# EAGLE design FR5969_BME280_v2.0.2 (EAGLE 8.1.0)
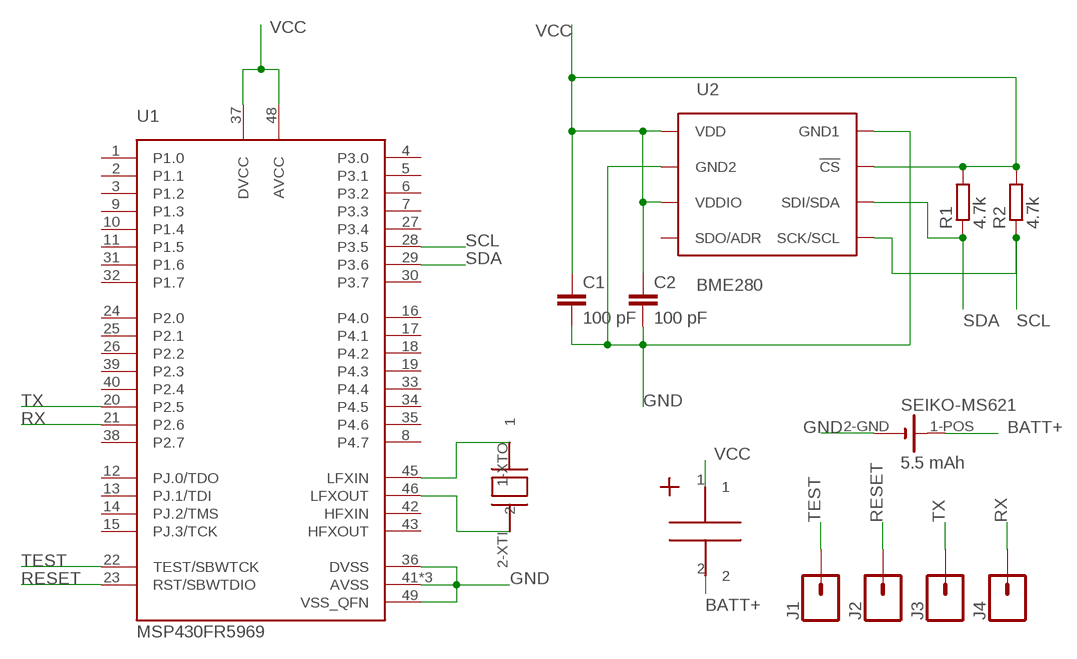
[diagram p0: schematic, sheet 1]

## Parts
C1  100 pF  C-EUC0201  [C0201]
C2  100 pF  C-EUC0201  [C0201]
J1  CONN_01  [1X01]
J2  CONN_01  [1X01]
J3  CONN_01  [1X01]
J4  CONN_01  [1X01]
R1  4.7k  R-EU_R0201  [R0201]
R2  4.7k  R-EU_R0201  [R0201]
SEIKO-MS621  5.5 mAh  SEIKO-MS621  [SEIKO_MICRO]
U1  MSP430FR5969  [S-PVQFN-N48]
U2  BME280  [BME280_LGA]
U$1  CPX3225  [CPX3225_CHIP-CAP]
U$2  ABS06  [2.0X1.0RTC]

## Nets
BATT+: SEIKO-MS621.1-POS(+) U$1.2
GND: C1.2 C2.2 SEIKO-MS621.2-GND(-) U1.36(DVSS) U1.41(AVSS) U1.44(AVSS) U1.47(AVSS) U1.49(VSS_QFN) U2.P$1(GND1) U2.P$7(GND2)
N$1: U1.46(LFXOUT) U$2.2-XTI
N$2: U1.45(LFXIN) U$2.1-XTO
RESET: J2.1 U1.23(RST/SBWTDIO)
RX: J4.1 U1.21(P2.6)
SCL: R2.1 U1.28(P3.5) U2.P$4(SCK/SCL)
SDA: R1.1 U1.29(P3.6) U2.P$3(SDI/SDA)
TEST: J1.1 U1.22(TEST/SBWTCK)
TX: J3.1 U1.20(P2.5)
VCC: C1.1 C2.1 R1.2 R2.2 U1.37(DVCC) U1.48(AVCC) U2.P$2(!CS) U2.P$6(VDDIO) U2.P$8(VDD) U$1.1
Unconnected: U1.1(P1.0) U1.2(P1.1) U1.3(P1.2) U1.4(P3.0) U1.5(P3.1) U1.6(P3.2) U1.7(P3.3) U1.8(P4.7) U1.9(P1.3) U1.10(P1.4) U1.11(P1.5) U1.12(PJ.0/TDO) U1.13(PJ.1/TDI) U1.14(PJ.2/TMS) U1.15(PJ.3/TCK) U1.16(P4.0) U1.17(P4.1) U1.18(P4.2) U1.19(P4.3) U1.24(P2.0) U1.25(P2.1) U1.26(P2.2) U1.27(P3.4) U1.30(P3.7) U1.31(P1.6) U1.32(P1.7) U1.33(P4.4) U1.34(P4.5) U1.35(P4.6) U1.38(P2.7) U1.39(P2.3) U1.40(P2.4) U1.42(HFXIN) U1.43(HFXOUT) U2.P$5(SDO/ADR)

## Library data of the parts
C1 C2 = resistor:C-EU: CAPACITOR, European symbol
J1-J4 = SparkFun-Connectors:CONN_01: Single connection point. Often used as Generic Header-pin footprint for 0.1 inch spaced/style header connections On any of the 0.1 inch spaced packages, you can populate with these: Break Away Headers - Straight <https://www.sparkfun.com/products/116> (PRT-00116) Break Away Male Headers - Right Angle <https://www.sparkfun.com/products/553> (PRT-00553) Female Headers <https://www.sparkfun.com/products/115> (PRT-00115) Break Away Headers - Machine Pin <https://www.sparkfun.com/products/117> (PRT-00117) Break Away Female Headers - Swiss Machine Pin <https://www.sparkfun.com/products/743> (PRT-00743) This device is also useful as a general connection point to wire up your design to another part of your project. Our various solder wires solder well into these plated through hole pads. Hook-Up Wire - Assortment (Stranded, 22 AWG) <https://www.sparkfun.com/products/11375> (PRT-11375) Hook-Up Wire - Assortment (Solid Core, 22 AWG) <https://www.sparkfun.com/products/11367> (PRT-11367) View the entire wire category on our website here <https://www.sparkfun.com/categories/141> Special notes: SMTSO-256-ET is a "flush mount" nut for a 4-40 screw. We mostly use this on specialty testbeds; it is a nice way to connect hardware to your PCB at an adjustable hieght. Also note, the SNAP packages are for using a snappable style connector. We sell a baggie of snaps and they are also used on two LilyPad designs: Snap Assortment - 30 pack (male and female) <https://www.sparkfun.com/products/11347> (DEV-11347) LilyPad Arduino SimpleSnap <https://www.sparkfun.com/products/10941> (DEV-10941) LilyPad SimpleSnap Protoboard <https://www.sparkfun.com/products/10940> (DEV-10940)
R1 R2 = resistor:R-EU_: RESISTOR, European symbol
SEIKO-MS621 = battery:SEIKO-MS621
U1 = chips:MSP430FR5969
U2 = BME280ComponentLibrary:BME280; PROD_ID: IC-13090
U$1 = seiko:CPX3225
U$2 = abracon:ABS06

## Board
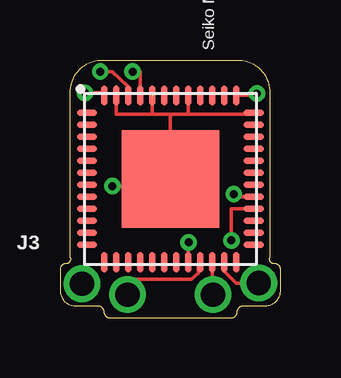
[diagram p1: board, top side]
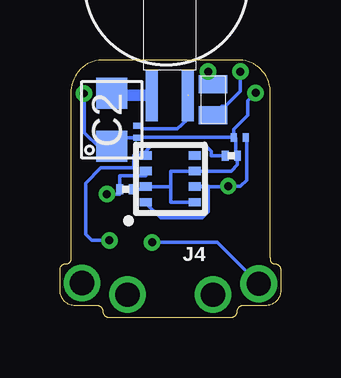
[diagram p2: board, bottom side, seen from below]

Size 9.19 x 10.74 mm. Coordinates in mm from the lower left corner, seen from the top.
Outline: 0,2.01 0,1.14 arc90 0.64,0.51 1.57,0.51 arc-90 1.83,0.25 arc90 2.08,0 7.14,0 arc90 7.39,0.25 arc-90 7.65,0.51 8.56,0.51 arc90 9.19,1.14 9.19,2.01 arc90 8.94,2.26 8.86,2.26 arc-90 8.74,2.51 8.74,9.47 arc90 7.34,10.74 1.83,10.74 arc90 0.43,9.47 0.43,2.51 arc-90 0.3,2.26 0.25,2.26 arc90 0,2.01
Copper layers (1*16): Top 0.0356mm / dielectric 1.5011mm / Bottom 0.0356mm
Design rules "LaenPCBOrder *": minimum track width 6mil, minimum drill 13mil, track to track 6mil, track to pad 6mil, pad to pad 6mil, via to via 6mil, smd to smd 6mil, copper to edge 15mil, drill to drill 6mil, minimum pad ring 7mil, minimum via ring 7mil, stop-mask expansion 3mil, vias tented up to drill 25mil, thermal gap 10mil

### Footprints (pad centres in the part's own frame; a part is rotated, then mirrored left to right if it is on the bottom)
C0201 = smd 0.25 x 0.35: 1 -0.25,0; 2 0.25,0
1X01 = drill 1.016 pad 1.27: 1 0,0
R0201 = smd 0.28 x 0.43: 1 -0.255,0; 2 0.255,0
SEIKO_MICRO = smd 2.1 x 0.5 bottom: 1-POS 0,0.75; 2-GND 0,-0.75
S-PVQFN-N48 = smd 0.85 x 0.28: 1 -3.475,2.75; 2 -3.475,2.25; 3 -3.475,1.75; 4 -3.475,1.25; 5 -3.475,0.75; 6 -3.475,0.25; 7 -3.475,-0.25; 8 -3.475,-0.75; 9 -3.475,-1.25; 10 -3.475,-1.75; 11 -3.475,-2.25; 12 -3.475,-2.75; 25 3.475,-2.75; 26 3.475,-2.25; 27 3.475,-1.75; 28 3.475,-1.25; 29 3.475,-0.75; 30 3.475,-0.25; 31 3.475,0.25; 32 3.475,0.75; 33 3.475,1.25; 34 3.475,1.75; 35 3.475,2.25; 36 3.475,2.75 | smd 0.28 x 0.85: 13 -2.75,-3.475; 14 -2.25,-3.475; 15 -1.75,-3.475; 16 -1.25,-3.475; 17 -0.75,-3.475; 18 -0.25,-3.475; 19 0.25,-3.475; 20 0.75,-3.475; 21 1.25,-3.475; 22 1.75,-3.475; 23 2.25,-3.475; 24 2.75,-3.475; 37 2.75,3.475; 38 2.25,3.475; 39 1.75,3.475; 40 1.25,3.475; 41 0.75,3.475; 42 0.25,3.475; 43 -0.25,3.475; 44 -0.75,3.475; 45 -1.25,3.475; 46 -1.75,3.475; 47 -2.25,3.475; 48 -2.75,3.475 | smd 4.064 x 4.064: 49 0,0
BME280_LGA = smd 0.5 x 0.35: P$1 1.025,0.975; P$2 1.025,0.325; P$3 1.025,-0.325; P$4 1.025,-0.975; P$5 -1.025,-0.975; P$6 -1.025,-0.325; P$7 -1.025,0.325; P$8 -1.025,0.975
CPX3225_CHIP-CAP = smd 1.3 x 1.3: 1 -1.1,0; 2 1.1,0
2.0X1.0RTC = smd 0.75 x 1.2: 1-XTO -0.65,0; 2-XTI 0.65,0

### Placement (x,y rotation side)
C1  1.7,7.52 0 bottom
C2  5.97,7.75 90 bottom
J1  6.38,0.97 0 bottom
J2  8.28,1.45 0 bottom
J3  0.91,1.42 0 bottom
J4  2.82,0.97 0 bottom
R1  6.45,5.36 0 bottom
R2  2.06,6.76 0 bottom
SEIKO-MS621  4.62,9.25 270 top
U1  4.6,5.79 0 top
U2  4.6,5.79 180 bottom
U$1  7.04,8.26 90 bottom
U$2  2.82,9.09 270 bottom

### Tracks (layer width: path | path; a pad name or v marks a point on that pad's centre or on a via)
BATT+
  Bottom 0.152: 6.85,9.27 U$1.2
  Bottom 0.508: SEIKO-MS621.1-POS 6.85,9.27
GND  (via drill 0.33 pad 0.53)  (1 unrouted)
  Top 0.152: 2.35,9.64 U1.47 2.34,9.27 2.34,8.48 3.85,8.48 | 3.84,9.6 3.85,9.59 U1.44 3.85,8.48 | U1.41 5.35,9.61 | U1.41 5.35,8.85 | U1.36 8.03,8.59 | U1.36 7.7,8.54 | 3.85,8.48 4.6,8.48 | 5.35,8.48 U1.41 | U1.36 8.07,8.48 5.35,8.48 | v2.18,5.49 4.6,5.49 U1.49 4.6,8.48 | 5.35,8.48 4.6,8.48
  Bottom 0.152: U2.P$1 5.64,4.82 5.64,4.8 5,4.17 3.28,4.17 3.02,4.42 3.02,5.49 3.57,5.49 U2.P$7 2.31,5.47 | 2.31,5.47 2.31,5.46 | C1.2 1.42,7.49 1.42,5.74 1.68,5.49 v2.18,5.49 2.31,5.47 | C2.2 5.8,7.87 4.32,7.87 3.89,8.26 3.89,9.05 SEIKO-MS621.2-GND
N$1  (via drill 0.33 pad 0.53)
  Top 0.152: v1.68,10.26 2.18,10.26 2.82,9.65 U1.46
  Bottom 0.152: v1.68,10.26 1.68,9.45 2.31,8.81 2.45,8.81 U$2.2-XTI
N$2  (via drill 0.33 pad 0.53)
  Top 0.152: U1.45 3.35,10.26 v3.02,10.26
  Bottom 0.152: v3.02,10.26 2.99,10.21 U$2.1-XTO
RESET
  Top 0.152: U1.23 6.8,1.99 7.34,1.45 J2.1
RX
  Top 0.152: U1.21 5.77,2.24 5.77,1.86 5.46,1.6 3.15,1.6 3.15,0.97 J4.1
SCL  (via drill 0.33 pad 0.53)
  Top 0.152: U1.28 7.14,4.54 v7.14,3.23
  Bottom 0.152: R2.1 2.9,6.76 2.9,6.93 3.15,7.19 5.37,7.19 5.62,6.93 U2.P$4 6.12,6.77 6.12,6.25 7.49,6.25 8.13,5.61 8.13,3.48 7.87,3.23 v7.14,3.23
SDA  (via drill 0.33 pad 0.53)
  Top 0.152: U1.29 7.39,5.04 7.39,5.18 7.24,5.18 v7.24,5.16
  Bottom 0.152: 5.62,6.07 U2.P$3 5.62,5.92 6.71,5.92 R1.1 6.71,5.16 v7.24,5.16
TEST
  Top 0.152: U1.22 6.35,0.99 J1.1
TX  (via drill 0.33 pad 0.53)
  Top 0.152: U1.20 5.33,2.33 5.33,3.2 5.36,3.18 v5.36,3.15
  Bottom 0.152: v5.36,3.15 2.64,3.15 J3.1
VCC  (via drill 0.33 pad 0.53)
  Top 0.152: 7.32,9.23 U1.37 8.13,9.27 v8.2,9.35 | U1.48 1.74,9.37 v1.04,9.37
  Bottom 0.152: v8.2,9.35 8.18,9.35 8.18,7.72 7.54,7.09 6.93,7.09 U$1.1 7.01,7.5 C2.1 5.69,7.52 C1.1 | 4.57,5.46 4.57,6.12 U2.P$6 2.06,6.12 1.8,6.37 R2.2 1.88,6.91 1.88,7.49 1.91,7.52 C1.1 | 4.57,5.46 U2.P$2 5.62,5.36 R1.2 | U2.P$8 4.57,4.82 4.57,5.46 | v1.04,9.37 1.37,9.04 1.37,8.43 1.95,7.85 C1.1